# EAGLE schematic Wiazka_Swiatla_Dzienne (EAGLE 8.6.0)
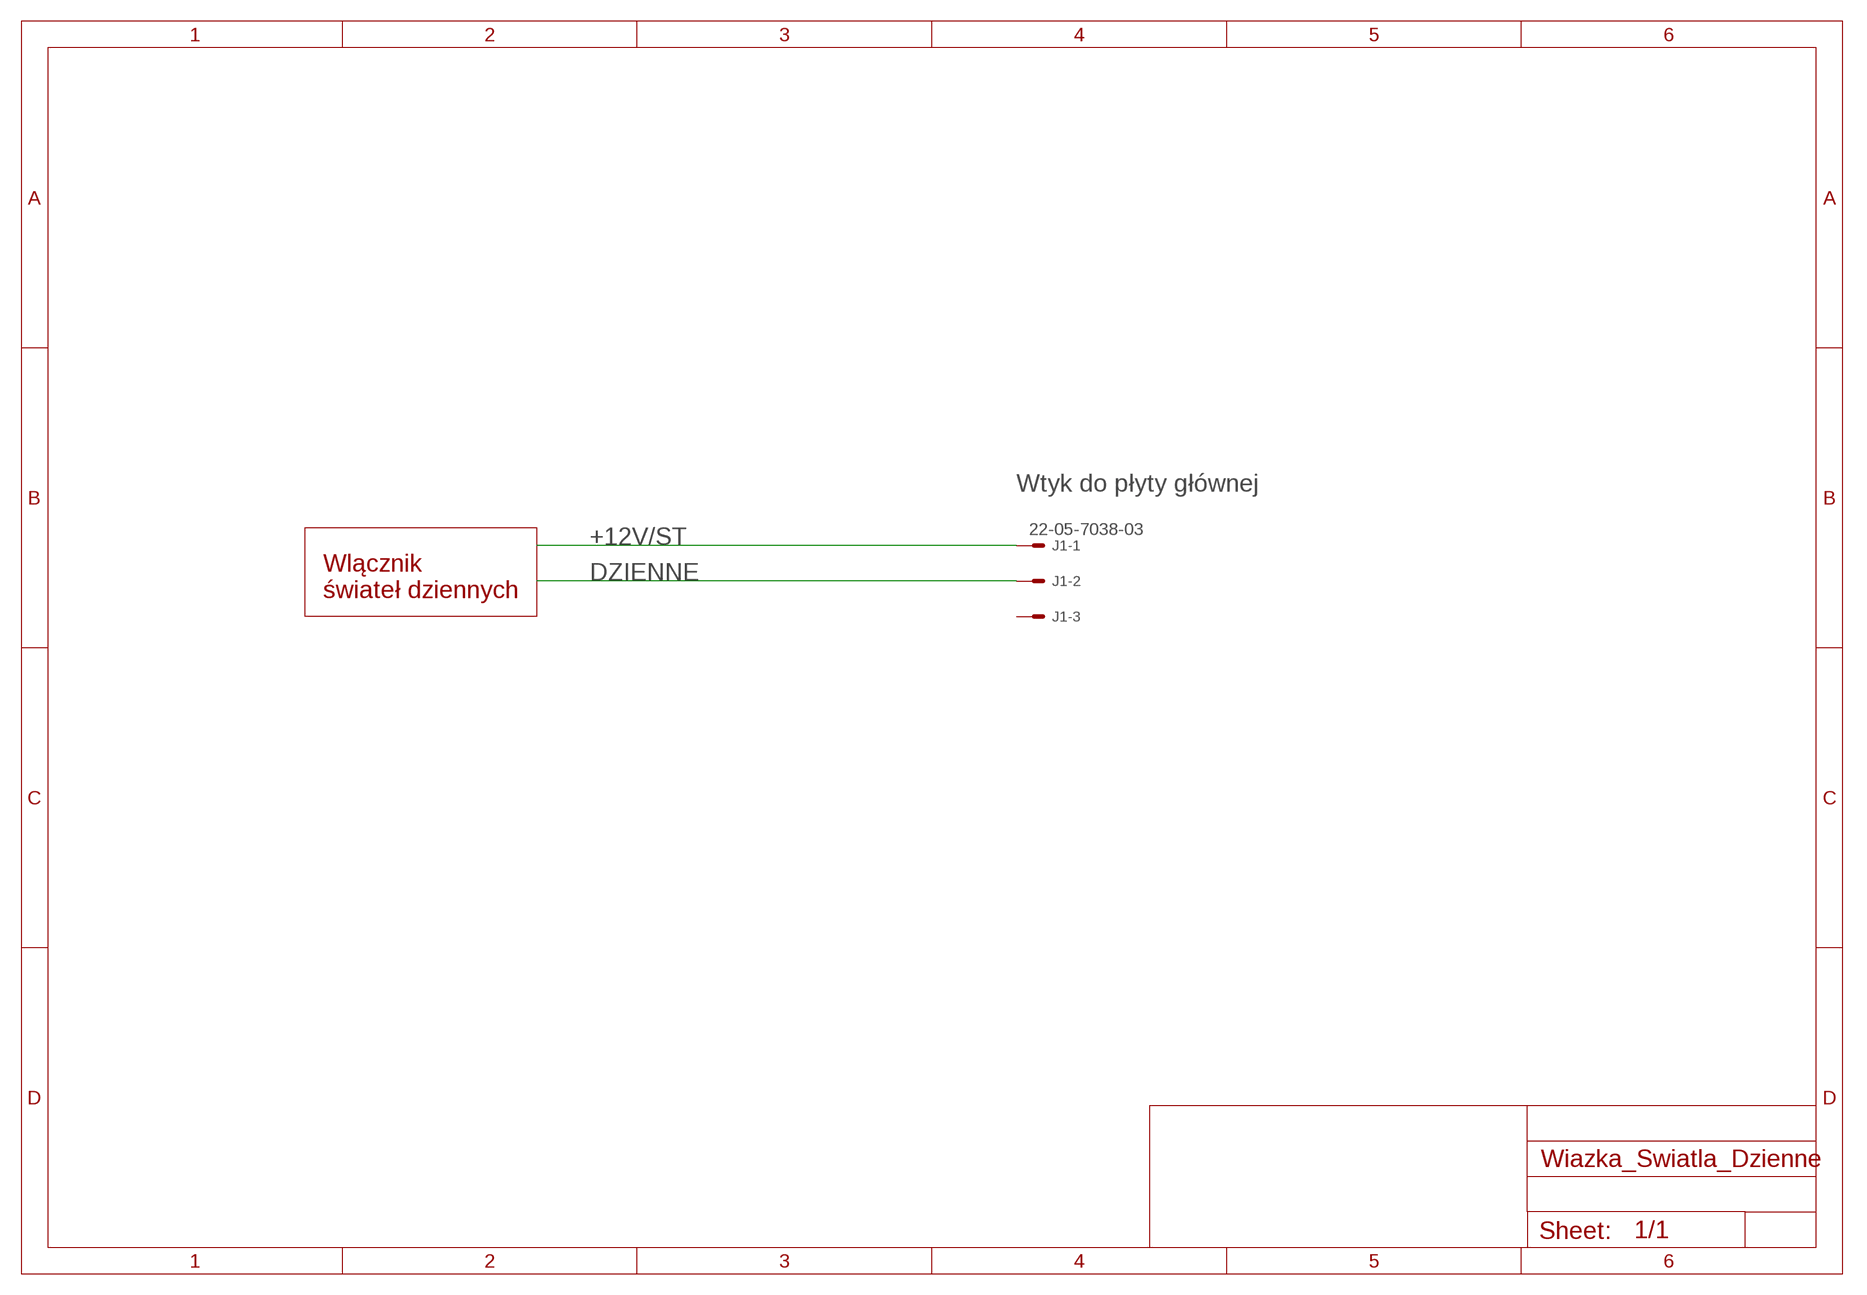
[diagram p0: schematic, sheet 1]

## Parts
J1  22-05-7038-03  [7395-03]

## Nets
+12V/ST: J1.1
DZIENNE: J1.2
Unconnected: J1.3

## Notes on the sheet
- Wtyk do płyty głównej
- Wlącznik
  świateł dziennych

## Library data of the parts
J1 = con-molex:22-?-03: CONNECTOR wire to board 2.54 mm (.1 inch) pitch header; MF: MOLEX; OC_FARNELL: unknown; OC_NEWARK: unknown